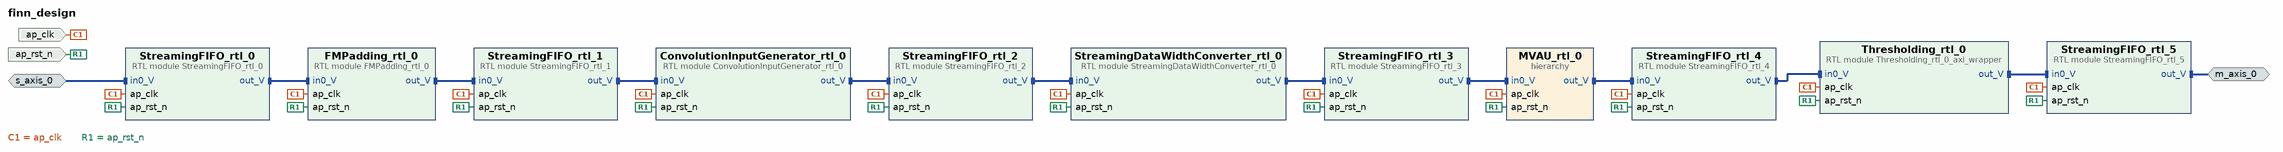
[diagram p0: block diagram of the top level]
# Vivado block design finn_design, xc7z020clg400-1, Vivado 2022.2
create_bd_design finn_design

create_bd_intf_port -mode Slave -vlnv xilinx.com:interface:axis_rtl:1.0 s_axis_0
set_property -dict [list \
  CONFIG.HAS_TKEEP 0 \
  CONFIG.HAS_TLAST 0 \
  CONFIG.HAS_TREADY 1 \
  CONFIG.HAS_TSTRB 0 \
  CONFIG.LAYERED_METADATA undef \
  CONFIG.TDATA_NUM_BYTES 2 \
  CONFIG.TDEST_WIDTH 0 \
  CONFIG.TID_WIDTH 0 \
  CONFIG.TUSER_WIDTH 0 \
] [get_bd_intf_ports s_axis_0]
create_bd_intf_port -mode Master -vlnv xilinx.com:interface:axis_rtl:1.0 m_axis_0
create_bd_port -dir I -type clk ap_clk
set_property -dict {CONFIG.FREQ_HZ 100000000} [get_bd_ports ap_clk]
create_bd_port -dir I -type rst ap_rst_n

create_bd_cell -type module -reference StreamingFIFO_rtl_0 StreamingFIFO_rtl_0
create_bd_cell -type module -reference FMPadding_rtl_0 FMPadding_rtl_0
create_bd_cell -type module -reference StreamingFIFO_rtl_1 StreamingFIFO_rtl_1
create_bd_cell -type module -reference ConvolutionInputGenerator_rtl_0 ConvolutionInputGenerator_rtl_0
create_bd_cell -type module -reference StreamingFIFO_rtl_2 StreamingFIFO_rtl_2
create_bd_cell -type module -reference StreamingDataWidthConverter_rtl_0 StreamingDataWidthConverter_rtl_0
create_bd_cell -type module -reference StreamingFIFO_rtl_3 StreamingFIFO_rtl_3
create_bd_cell -type hier MVAU_rtl_0
create_bd_cell -type module -reference StreamingFIFO_rtl_4 StreamingFIFO_rtl_4
create_bd_cell -type module -reference Thresholding_rtl_0_axi_wrapper Thresholding_rtl_0
create_bd_cell -type module -reference StreamingFIFO_rtl_5 StreamingFIFO_rtl_5

# ---- hierarchy /MVAU_rtl_0 ----
current_bd_instance /MVAU_rtl_0
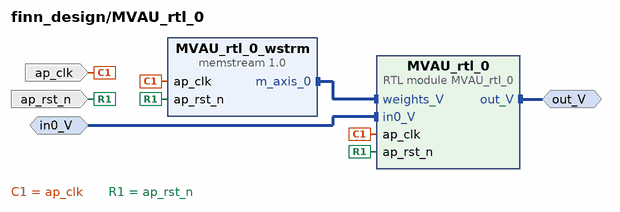
[diagram p1: block diagram inside /MVAU_rtl_0]
create_bd_intf_pin -mode Master -vlnv xilinx.com:interface:axis_rtl:1.0 out_V
create_bd_intf_pin -mode Slave -vlnv xilinx.com:interface:axis_rtl:1.0 in0_V
create_bd_pin -dir I -type clk ap_clk
create_bd_pin -dir I -type rst ap_rst_n

create_bd_cell -type module -reference MVAU_rtl_0 MVAU_rtl_0
create_bd_cell -type ip -vlnv amd.com:finn:memstream:1.0 MVAU_rtl_0_wstrm
set_property -dict [list \
  CONFIG.DEPTH 2 \
  CONFIG.INIT_FILE /tmp/finn_dev_rothej/code_gen_ipgen_MVAU_rtl_0_wcz0j_3o/memblock.dat \
  CONFIG.RAM_STYLE auto \
  CONFIG.WIDTH 576 \
] [get_bd_cells MVAU_rtl_0_wstrm]

# ---- connections ----

current_bd_instance /MVAU_rtl_0
connect_bd_intf_net [get_bd_intf_pins out_V] [get_bd_intf_pins MVAU_rtl_0/out_V]
connect_bd_intf_net [get_bd_intf_pins MVAU_rtl_0_wstrm/m_axis_0] [get_bd_intf_pins MVAU_rtl_0/weights_V]
connect_bd_intf_net [get_bd_intf_pins in0_V] [get_bd_intf_pins MVAU_rtl_0/in0_V]
connect_bd_net [get_bd_pins ap_clk] [get_bd_pins MVAU_rtl_0_wstrm/ap_clk] [get_bd_pins MVAU_rtl_0/ap_clk]
connect_bd_net [get_bd_pins ap_rst_n] [get_bd_pins MVAU_rtl_0_wstrm/ap_rst_n] [get_bd_pins MVAU_rtl_0/ap_rst_n]

current_bd_instance /
connect_bd_intf_net [get_bd_intf_pins ConvolutionInputGenerator_rtl_0/out_V] [get_bd_intf_pins StreamingFIFO_rtl_2/in0_V]
connect_bd_intf_net [get_bd_intf_pins FMPadding_rtl_0/out_V] [get_bd_intf_pins StreamingFIFO_rtl_1/in0_V]
connect_bd_intf_net [get_bd_intf_pins MVAU_rtl_0/out_V] [get_bd_intf_pins StreamingFIFO_rtl_4/in0_V]
connect_bd_intf_net [get_bd_intf_pins StreamingDataWidthConverter_rtl_0/out_V] [get_bd_intf_pins StreamingFIFO_rtl_3/in0_V]
connect_bd_intf_net [get_bd_intf_pins StreamingFIFO_rtl_0/out_V] [get_bd_intf_pins FMPadding_rtl_0/in0_V]
connect_bd_intf_net [get_bd_intf_pins StreamingFIFO_rtl_1/out_V] [get_bd_intf_pins ConvolutionInputGenerator_rtl_0/in0_V]
connect_bd_intf_net [get_bd_intf_pins StreamingFIFO_rtl_2/out_V] [get_bd_intf_pins StreamingDataWidthConverter_rtl_0/in0_V]
connect_bd_intf_net [get_bd_intf_pins StreamingFIFO_rtl_3/out_V] [get_bd_intf_pins MVAU_rtl_0/in0_V]
connect_bd_intf_net [get_bd_intf_pins StreamingFIFO_rtl_4/out_V] [get_bd_intf_pins Thresholding_rtl_0/in0_V]
connect_bd_intf_net [get_bd_intf_ports m_axis_0] [get_bd_intf_pins StreamingFIFO_rtl_5/out_V]
connect_bd_intf_net [get_bd_intf_pins Thresholding_rtl_0/out_V] [get_bd_intf_pins StreamingFIFO_rtl_5/in0_V]
connect_bd_intf_net -intf_net in0_V_0_1 [get_bd_intf_ports s_axis_0] [get_bd_intf_pins StreamingFIFO_rtl_0/in0_V]
connect_bd_net -net ap_clk_0_1 [get_bd_ports ap_clk] \
  [get_bd_pins StreamingFIFO_rtl_0/ap_clk] [get_bd_pins FMPadding_rtl_0/ap_clk] [get_bd_pins StreamingFIFO_rtl_1/ap_clk] \
  [get_bd_pins ConvolutionInputGenerator_rtl_0/ap_clk] [get_bd_pins StreamingFIFO_rtl_2/ap_clk] \
  [get_bd_pins StreamingDataWidthConverter_rtl_0/ap_clk] [get_bd_pins StreamingFIFO_rtl_3/ap_clk] \
  [get_bd_pins MVAU_rtl_0/ap_clk] [get_bd_pins StreamingFIFO_rtl_4/ap_clk] [get_bd_pins Thresholding_rtl_0/ap_clk] \
  [get_bd_pins StreamingFIFO_rtl_5/ap_clk]
connect_bd_net -net ap_rst_n_0_1 [get_bd_ports ap_rst_n] \
  [get_bd_pins StreamingFIFO_rtl_0/ap_rst_n] [get_bd_pins FMPadding_rtl_0/ap_rst_n] \
  [get_bd_pins StreamingFIFO_rtl_1/ap_rst_n] [get_bd_pins ConvolutionInputGenerator_rtl_0/ap_rst_n] \
  [get_bd_pins StreamingFIFO_rtl_2/ap_rst_n] [get_bd_pins StreamingDataWidthConverter_rtl_0/ap_rst_n] \
  [get_bd_pins StreamingFIFO_rtl_3/ap_rst_n] [get_bd_pins MVAU_rtl_0/ap_rst_n] [get_bd_pins StreamingFIFO_rtl_4/ap_rst_n] \
  [get_bd_pins Thresholding_rtl_0/ap_rst_n] [get_bd_pins StreamingFIFO_rtl_5/ap_rst_n]

validate_bd_design
save_bd_design
